# EAGLE schematic sidpi-revd (EAGLE 6.5.0)
.,m,.m,.m,.m,.m.,m
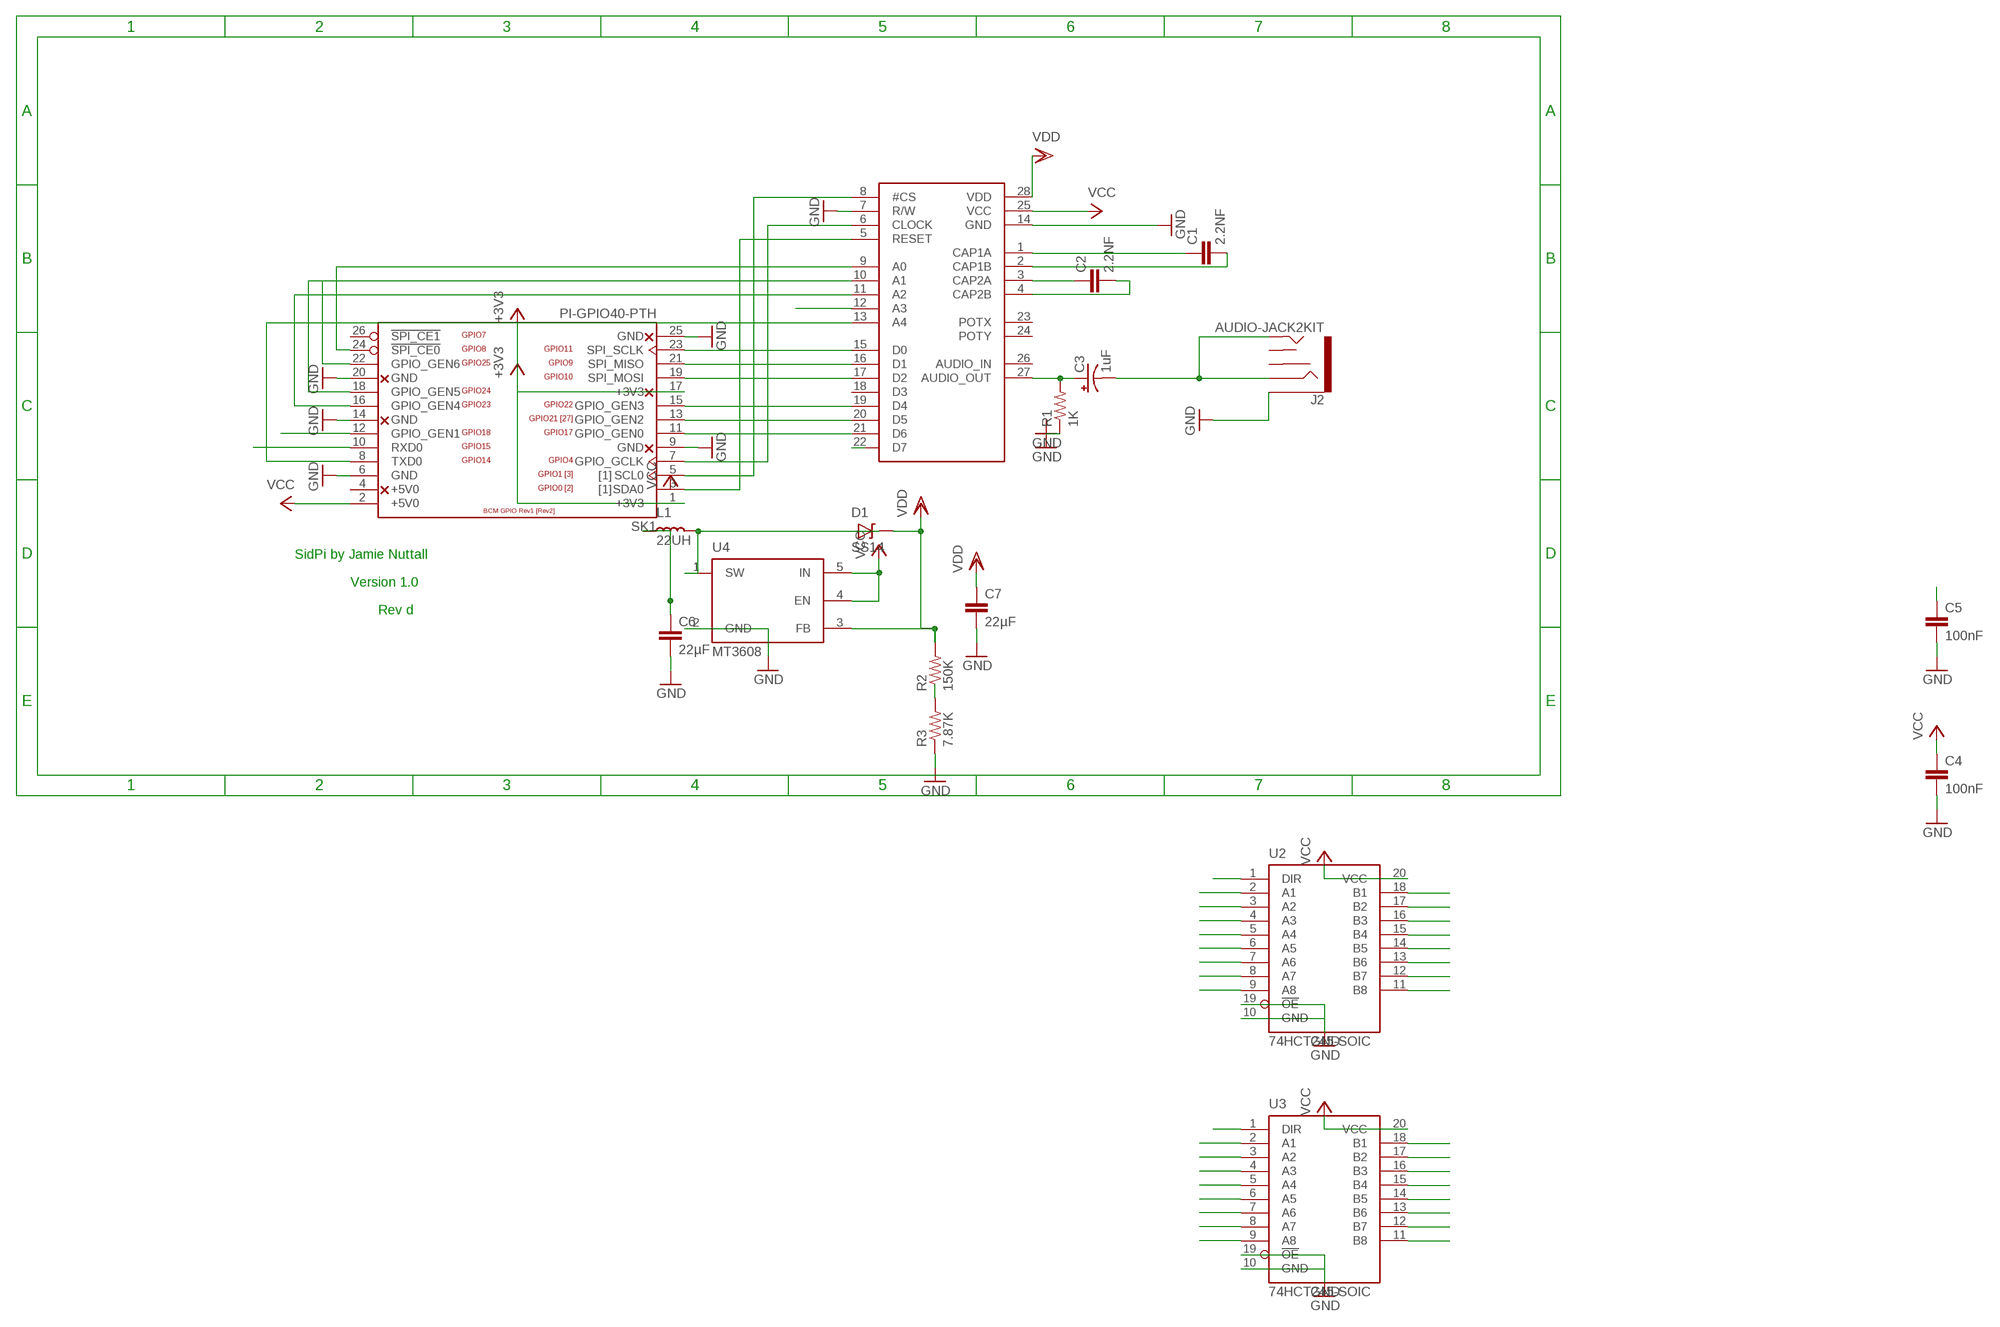
[diagram p0: schematic, sheet 1]

## Parts
C1  2.2NF  CAP0805  [0805]
C2  2.2NF  CAP0805  [0805]
C3  1uF  CPOL-USE1.8-4  [E1,8-4]
C4  100nF  CAP0805  [0805]
C5  100nF  CAP0805  [0805]
C6  22µF  CAP0805  [0805]
C7  22µF  CAP0805  [0805]
D1  SS14  [SOD-123]
J2  AUDIO-JACK2KIT  [AUDIO-JACK-KIT]
L1  22UH  [IND-5X5]
R1  1K  R-US_R0805  [R0805]
R2  150K  R-US_R0805  [R0805]
R3  7.87K  R-US_R0805  [R0805]
SK1  PI-GPIO40-PTH  [GPIO-CONNECTOR-40]
U2  74HCT245-SOIC  [SOIC20W]
U3  74HCT245-SOIC  [SOIC20W]
U4  MT3608  [SOT-23-6]
U$1  6581  [DIL28-6]

## Nets
+3V3: SK1.1(+3V3) SK1.17(+3V3) U2.1(DIR) U3.1(DIR)
GND: C4.2 C5.2 C6.2 C7.2 J2.SLEEVE R1.1 R3.1 SK1.6(GND) SK1.9(GND) SK1.14(GND) SK1.20(GND) SK1.25(GND) U2.10(GND) U2.19(!OE) U3.10(GND) U3.19(!OE) U4.2(GND) U$1.7(R/W) U$1.14(GND)
N$1: SK1.5(SCL0) U3.7(A6) U3.13(B6) U$1.8(#CS)
N$2: SK1.12(GPIO_GEN1) U3.5(A4) U3.15(B4) U$1.12(A3)
N$3: C1.1 U$1.1(CAP1A)
N$4: SK1.8(TXD0) U3.6(A5) U3.14(B5) U$1.13(A4)
N$5: SK1.10(RXD0) U2.9(A8) U2.11(B8) U$1.22(D7)
N$6: C2.1 U$1.3(CAP2A)
N$7: SK1.11(GPIO_GEN0) U2.8(A7) U2.12(B7) U$1.21(D6)
N$8: C3.- J2.RING J2.TIP
N$9: SK1.7(GPIO_GCLK) U3.8(A7) U3.12(B7) U$1.6(CLOCK)
N$10: SK1.13(GPIO_GEN2) U2.7(A6) U2.13(B6) U$1.20(D5)
N$11: SK1.15(GPIO_GEN3) U2.6(A5) U2.14(B5) U$1.19(D4)
N$12: SK1.18(GPIO_GEN5) U2.5(A4) U2.15(B4) U$1.18(D3)
N$13: SK1.19(SPI_MOSI) U2.4(A3) U2.16(B3) U$1.17(D2)
N$14: SK1.21(SPI_MISO) U2.3(A2) U2.17(B2) U$1.16(D1)
N$15: C2.2 U$1.4(CAP2B)
N$17: C1.2 U$1.2(CAP1B)
N$19: SK1.23(SPI_SCLK) U2.2(A1) U2.18(B1) U$1.15(D0)
N$20: SK1.16(GPIO_GEN4) U3.4(A3) U3.16(B3) U$1.11(A2)
N$23: C3.+ R1.2 U$1.27(AUDIO_OUT)
N$24: SK1.24(!SPI_CE0) U3.2(A1) U3.18(B1) U$1.9(A0)
N$25: SK1.22(GPIO_GEN6) U3.3(A2) U3.17(B2) U$1.10(A1)
N$26: SK1.3(SDA0) U3.9(A8) U3.11(B8) U$1.5(RESET)
N$27: D1.A L1.2 U4.1(SW)
N$29: R2.1 R3.2 U4.3(FB)
VCC [VCC]: C4.1 C6.1 L1.1 SK1.2(+5V0) U2.20(VCC) U3.20(VCC) U4.4(EN) U4.5(IN) U$1.25(VCC)
VDD [VDD]: C5.1 C7.1 D1.C R2.2 U$1.28(VDD)
Unconnected: J2.RSH J2.TSH SK1.4(+5V0) SK1.26(!SPI_CE1) U$1.23(POTX) U$1.24(POTY) U$1.26(AUDIO_IN)

## Notes on the sheet
- SidPi by Jamie Nuttall
- Version 1.0
- Rev d

## Library data of the parts
C1 C2 C4-C7 = SparkFun-Capacitors:CAP: Capacitor Standard 0603 ceramic capacitor, and 0.1" leaded capacitor.
C3 = adafruit:CPOL-US: POLARIZED CAPACITOR, American symbol
D1 = diodes:SS14
J2 = SparkFun-Connectors:AUDIO-JACK2: Stereo audio jack with bypass switches. SMT version used on LilyPad MP3 board.; PROD_ID: CONN-08774
L1 = inductors:22UH
R1-R3 = adafruit:R-US_: RESISTOR, American symbol
SK1 = jt-raspberry-pi:PI-: Raspberry Pi; OC_FARNELL: unknown
U2 U3 = 74HCT245:74HCT245
U4 = MT3608:MT3608
U$1 = Mos6581_sid:6581: The Famous C64 Sound Chip - MOS6581; OC_FARNELL: unknown

## Net classes
0 default: width 0.5 mm, drill 0.4 mm, clearance 0.5 mm
1 VDD: width 1 mm, drill 0.4 mm, clearance 0.5 mm
2 VCC: width 1 mm, drill 0.4 mm, clearance 0.5 mm